# Altium schematic sheet OpenMoteSTM-Border_JTAG.SchDoc
size A4
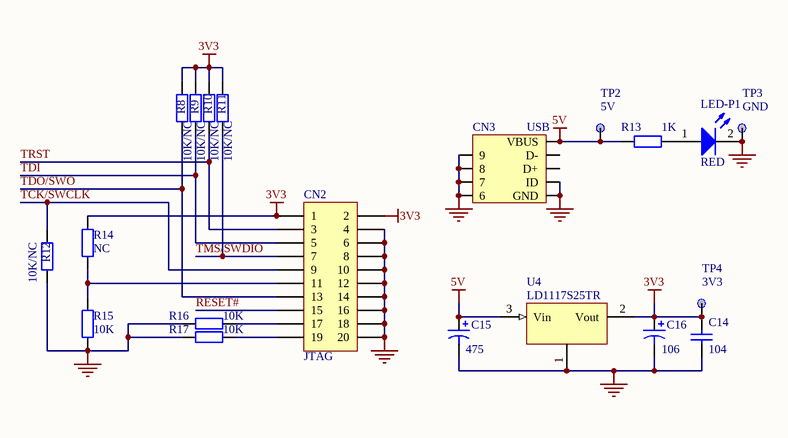
[diagram p0: OpenMoteSTM-Border_JTAG.SchDoc]

## Parts
C14  value 104  [0603]  (hidden comment: Cap)
C15  value 475  [1210]  (hidden comment: Cap Pol1)
C16  value 106  [1210]  (hidden comment: Cap Pol1)
CN2  JTAG  [HDR2X10]
CN3  USB  [MINI-USB]
LED-P1  RED  [0603]
R8  value 10K/NC  [0603]  (hidden comment: Res2)
R9  value 10K/NC  [0603]  (hidden comment: Res2)
R10  value 10K/NC  [0603]  (hidden comment: Res2)
R11  value 10K/NC  [0603]  (hidden comment: Res2)
R12  value 10K/NC  [0603]  (hidden comment: Res2)
R13  value 1K  [0603]  (hidden comment: Res2)
R14  value NC  [0603]  (hidden comment: Res2)
R15  value 10K  [0603]  (hidden comment: Res2)
R16  value 10K  [0603]  (hidden comment: Res2)
R17  value 10K  [0603]  (hidden comment: Res2)
TP2  5V  [TP]
TP3  GND  [TP]
TP4  3V3  [TP]
U4  LD1117S25TR  [LD1117]

## Nets
3V3: C14.2 C16.1 CN2.1 CN2.2 R8.2 R9.2 R10.2 R11.2 R14.2 TP4.1 U4.2(Vout)
5V: C15.1 CN3.1(VBUS) R13.2 TP2.1 U4.3(Vin)
GND: C14.1 C15.2 C16.2 CN2.4 CN2.6 CN2.8 CN2.10 CN2.12 CN2.14 CN2.16 CN2.18 CN2.20 CN3.4(ID) CN3.5(GND) CN3.6 CN3.7 CN3.8 CN3.9 LED-P1.2(K) R12.1 R15.1 R16.2 R17.2 TP3.1 U4.1
RESET#: CN2.15
TCK/SWCLK: CN2.9 R12.2
TDI: CN2.5 R9.1
TDO/SWO: CN2.13 R8.1
TMS/SWDIO: CN2.7 R11.1
TRST: CN2.3 R10.1
NetCN2_11: CN2.11 R14.1 R15.2
NetCN2_17: CN2.17 R16.1
NetCN2_19: CN2.19 R17.1
NetLED-P1_1: LED-P1.1(A) R13.1

Not connected (* = marked no-connect by the designer): CN3 2(D-) 3(D+)

## Library data of the parts
C14 = Cap: Capacitor; Published: 8-Jun-2000; LatestRevisionDate: 17-Jul-2002; LatestRevisionNote: Re-released for DXP Platform.; PackageReference: RAD-0.3; Publisher: Altium Limited
C15 C16 = Cap Pol1: Polarized Capacitor (Radial); Published: 8-Jun-2000; LatestRevisionDate: 17-Jul-2002; LatestRevisionNote: Re-released for DXP Platform.; PackageReference: RB7.6-15; Publisher: Altium Limited
CN2 = Header 10X2: Header, 10-Pin, Dual row; LatestRevisionDate: 17-Jul-2002; LatestRevisionNote: Re-released for DXP Platform.; Publisher: Altium Limited
CN3 = MINIUSB_A
LED-P1 = LED2: Typical RED, GREEN, YELLOW, AMBER GaAs LED; Published: 8-Jun-2000; Revision: July-2002: Re-released for DXP Platform.; Publisher: Altium Limited
R8-R17 = Res2: Resistor; Published: 8-Jun-2000; LatestRevisionDate: 17-Jul-2002; LatestRevisionNote: Re-released for DXP Platform.; PackageReference: AXIAL-0.4; Publisher: Altium Limited
TP2-TP4 = TP
U4 = LD1117